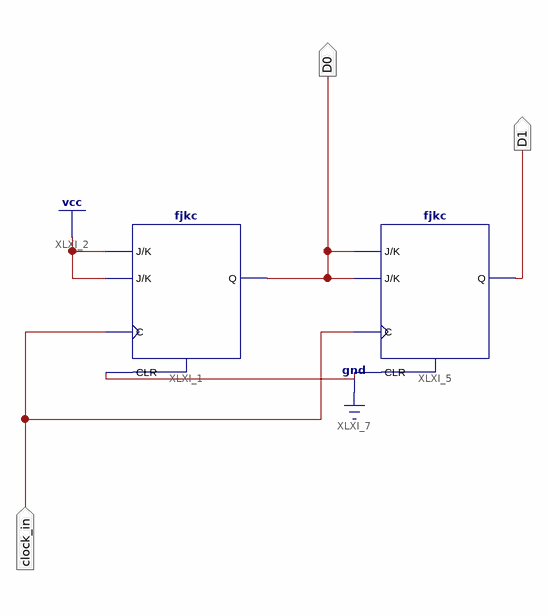
[diagram p0: schematic sheet 1]
// Xilinx ISE schematic counter4.sch (spartan6) as structural Verilog: 2 symbols, 3 ports
module counter4 (
  input  clock_in,
  output D0,
  output D1
);

  fjkc XLXI_1 (.C(clock_in), .CLR(1'b0), .J(1'b1), .K(1'b1), .Q(D0));
  fjkc XLXI_5 (.C(clock_in), .CLR(1'b0), .J(D0), .K(D0), .Q(D1));
endmodule
